# EAGLE design Arduino Programmer (EAGLE 9.6.1)
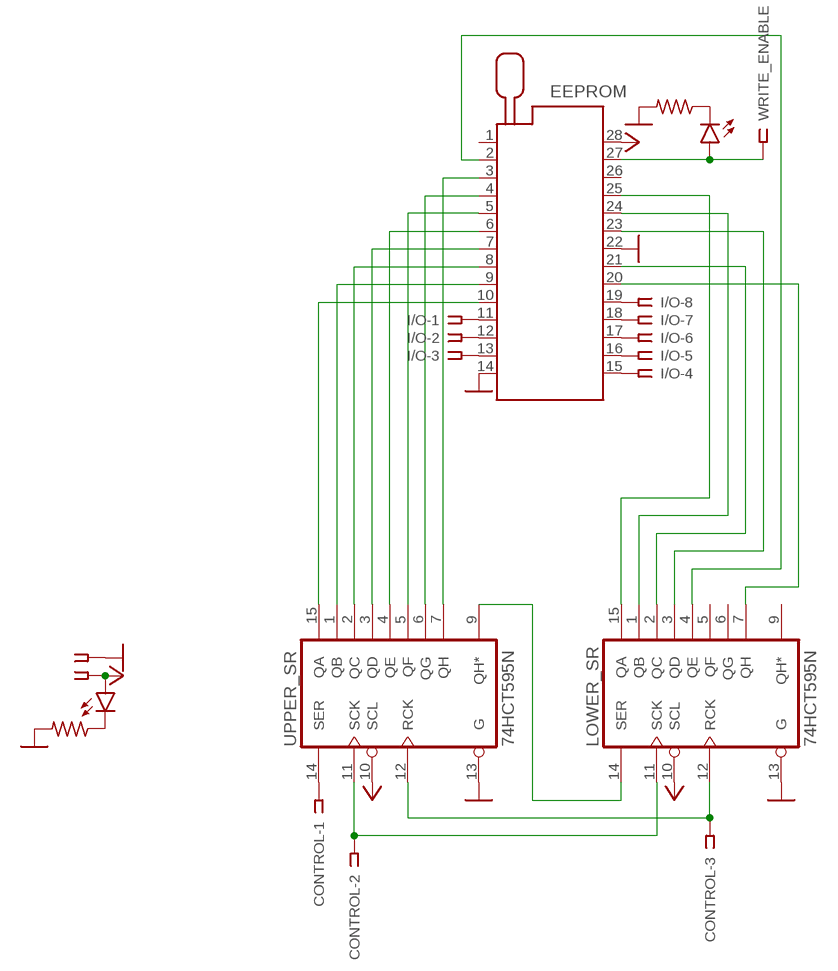
[diagram p0: schematic, sheet 1]

## Parts
CLK  LED5MM  [LED5MM]
CONTROL  SSW-101-02-G-T  [SSW-101-02-G-T]
EEPROM  228-1277-00-0602J  [228-1277-00-0602J]
I/O  SSW-108-02-G-S  [SSW-108-02-G-S]
LOWER_SR  74HCT595N  [DIL16]
POWER  LED5MM  [LED5MM]
R1  R-US_0204/7  [0204/7]
R2  R-US_0204/7  [0204/7]
UPPER_SR  74HCT595N  [DIL16]
WRITE_ENABLE  SSW-101-02-G-S  [SSW-101-02-G-S]
X2  SSW-102-02-G-S  [SSW-102-02-G-S]

## Nets
GND: EEPROM.14 EEPROM.22 LOWER_SR.13(G) R1.2 R2.2 UPPER_SR.13(G) X2.1
N$1: CONTROL.3 LOWER_SR.12(RCK) UPPER_SR.12(RCK)
N$2: CONTROL.2 LOWER_SR.11(SCK) UPPER_SR.11(SCK)
N$3: LOWER_SR.14(SER) UPPER_SR.9(QH*)
N$4: CONTROL.1 UPPER_SR.14(SER)
N$5: EEPROM.10 UPPER_SR.15(QA)
N$6: EEPROM.9 UPPER_SR.1(QB)
N$7: EEPROM.8 UPPER_SR.2(QC)
N$8: EEPROM.7 UPPER_SR.3(QD)
N$9: EEPROM.6 UPPER_SR.4(QE)
N$10: EEPROM.5 UPPER_SR.5(QF)
N$11: EEPROM.4 UPPER_SR.6(QG)
N$12: EEPROM.3 UPPER_SR.7(QH)
N$13: EEPROM.25 LOWER_SR.15(QA)
N$14: EEPROM.24 LOWER_SR.1(QB)
N$15: EEPROM.21 LOWER_SR.2(QC)
N$16: EEPROM.23 LOWER_SR.3(QD)
N$17: EEPROM.2 LOWER_SR.4(QE)
N$18: EEPROM.20 LOWER_SR.7(QH)
N$19: EEPROM.16 I/O.5
N$20: EEPROM.17 I/O.6
N$21: EEPROM.18 I/O.7
N$22: EEPROM.19 I/O.8
N$23: EEPROM.11 I/O.1
N$24: EEPROM.12 I/O.2
N$25: EEPROM.13 I/O.3
N$26: EEPROM.15 I/O.4
N$27: CLK.A EEPROM.27 WRITE_ENABLE.1
N$28: CLK.K(C) R1.1
N$29: POWER.K(C) R2.1
VCC: EEPROM.28 LOWER_SR.10(SCL) POWER.A UPPER_SR.10(SCL) X2.2
Unconnected: EEPROM.1 EEPROM.26 LOWER_SR.5(QF) LOWER_SR.6(QG) LOWER_SR.9(QH*)

## Power pins joined to a net without a drawn wire
GND: LOWER_SR.8(GND) UPPER_SR.8(GND)
VCC: LOWER_SR.16(VCC) UPPER_SR.16(VCC)

## Library data of the parts
CLK POWER = led:LED: LED OSRAM: - CHIPLED LG R971, LG N971, LY N971, LG Q971, LY Q971, LO R971, LY R971 LH N974, LH R974 LS Q976, LO Q976, LY Q976 LO Q996 - Hyper CHIPLED LW Q18S LB Q993, LB Q99A, LB R99A - SideLED LS A670, LO A670, LY A670, LG A670, LP A670 LB A673, LV A673, LT A673, LW A673 LH A674 LY A675 LS A676, LA A676, LO A676, LY A676, LW A676 LS A679, LY A679, LG A679 - Hyper Micro SIDELED® LS Y876, LA Y876, LO Y876, LY Y876 LT Y87S - SmartLED LW L88C, LW L88S LB L89C, LB L89S, LG L890 LS L89K, LO L89K, LY L89K LS L896, LA L896, LO L896, LY L896 - TOPLED LS T670, LO T670, LY T670, LG T670, LP T670 LSG T670, LSP T670, LSY T670, LOP T670, LYG T670 LG T671, LOG T671, LSG T671 LB T673, LV T673, LT T673, LW T673 LH T674 LS T676, LA T676, LO T676, LY T676, LB T676, LH T676, LSB T676, LW T676 LB T67C, LV T67C, LT T67C, LS T67K, LO T67K, LY T67K, LW E67C LS E67B, LA E67B, LO E67B, LY E67B, LB E67C, LV E67C, LT E67C LW T67C LS T679, LY T679, LG T679 LS T770, LO T770, LY T770, LG T770, LP T770 LB T773, LV T773, LT T773, LW T773 LH T774 LS E675, LA E675, LY E675, LS T675 LS T776, LA T776, LO T776, LY T776, LB T776 LHGB T686 LT T68C, LB T68C - Hyper Mini TOPLED® LB M676 - Mini TOPLED Santana® LG M470 LS M47K, LO M47K, LY M47K Source: http://www.osram.convergy.de LUXEON: - LUMILED® LXK2-PW12-R00, LXK2-PW12-S00, LXK2-PW14-U00, LXK2-PW14-V00 LXK2-PM12-R00, LXK2-PM12-S00, LXK2-PM14-U00 LXK2-PE12-Q00, LXK2-PE12-R00, LXK2-PE12-S00, LXK2-PE14-T00, LXK2-PE14-U00 LXK2-PB12-K00, LXK2-PB12-L00, LXK2-PB12-M00, LXK2-PB14-N00, LXK2-PB14-P00, LXK2-PB14-Q00 LXK2-PR12-L00, LXK2-PR12-M00, LXK2-PR14-Q00, LXK2-PR14-R00 LXK2-PD12-Q00, LXK2-PD12-R00, LXK2-PD12-S00 LXK2-PH12-R00, LXK2-PH12-S00 LXK2-PL12-P00, LXK2-PL12-Q00, LXK2-PL12-R00 Source: www.luxeon.com KINGBRIGHT: KA-3528ASYC Source: www.kingbright.com
CONTROL = con-samtec:SSW-101-02-G-T: THROUGH-HOLE .025" SQ POST SOCKET Source: Samtec SSW.pdf; MF: Samtec Inc.; MPN: SSW-101-02-G-T; OC_FARNELL: unknown; OC_NEWARK: 82P1460
EEPROM = con-3m:228-?00-0602J: Zero Insertion Force Socked Source: http://www.3M.com/ehpd; MF: 3M; MPN: 228-1277-00-0602J; OC_FARNELL: 9897356; OC_NEWARK: 85K7825
I/O = con-samtec:SSW-108-02-G-S: THROUGH-HOLE .025" SQ POST SOCKET Source: Samtec SSW.pdf; MF: Samtec Inc.; MPN: SSW-108-02-G-S; OC_FARNELL: unknown; OC_NEWARK: 11P9448
LOWER_SR UPPER_SR = 74xx-eu:74*595: 8-bit SHIFT REGISTER, output latch
R1 R2 = rcl:R-US_: RESISTOR, American symbol; SPICEPREFIX: R
WRITE_ENABLE = con-samtec:SSW-101-02-G-S: THROUGH-HOLE .025" SQ POST SOCKET Source: Samtec SSW.pdf; MF: Samtec Inc.; MPN: SSW-101-02-G-S; OC_FARNELL: unknown; OC_NEWARK: 11P9336
X2 = con-samtec:SSW-102-02-G-S: THROUGH-HOLE .025" SQ POST SOCKET Source: Samtec SSW.pdf; MF: Samtec Inc.; MPN: SSW-102-02-G-S; OC_FARNELL: unknown; OC_NEWARK: 11P9351

## Board
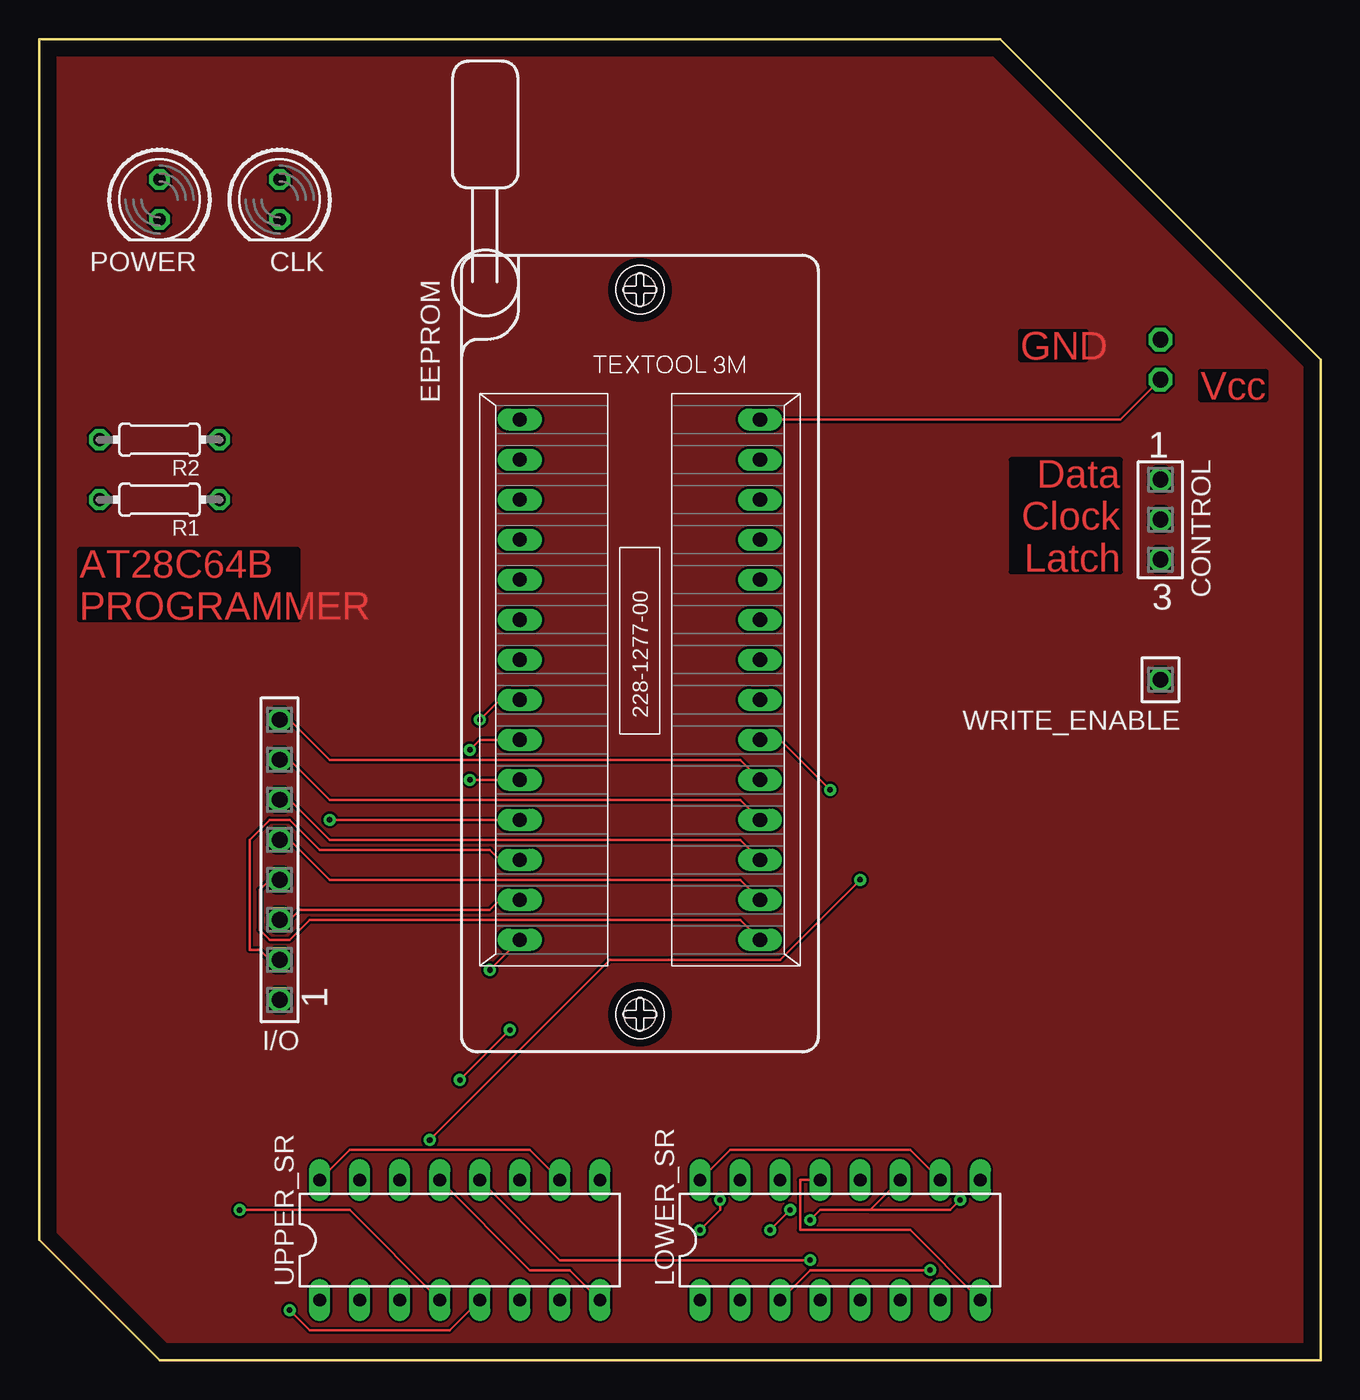
[diagram p1: board, top side]
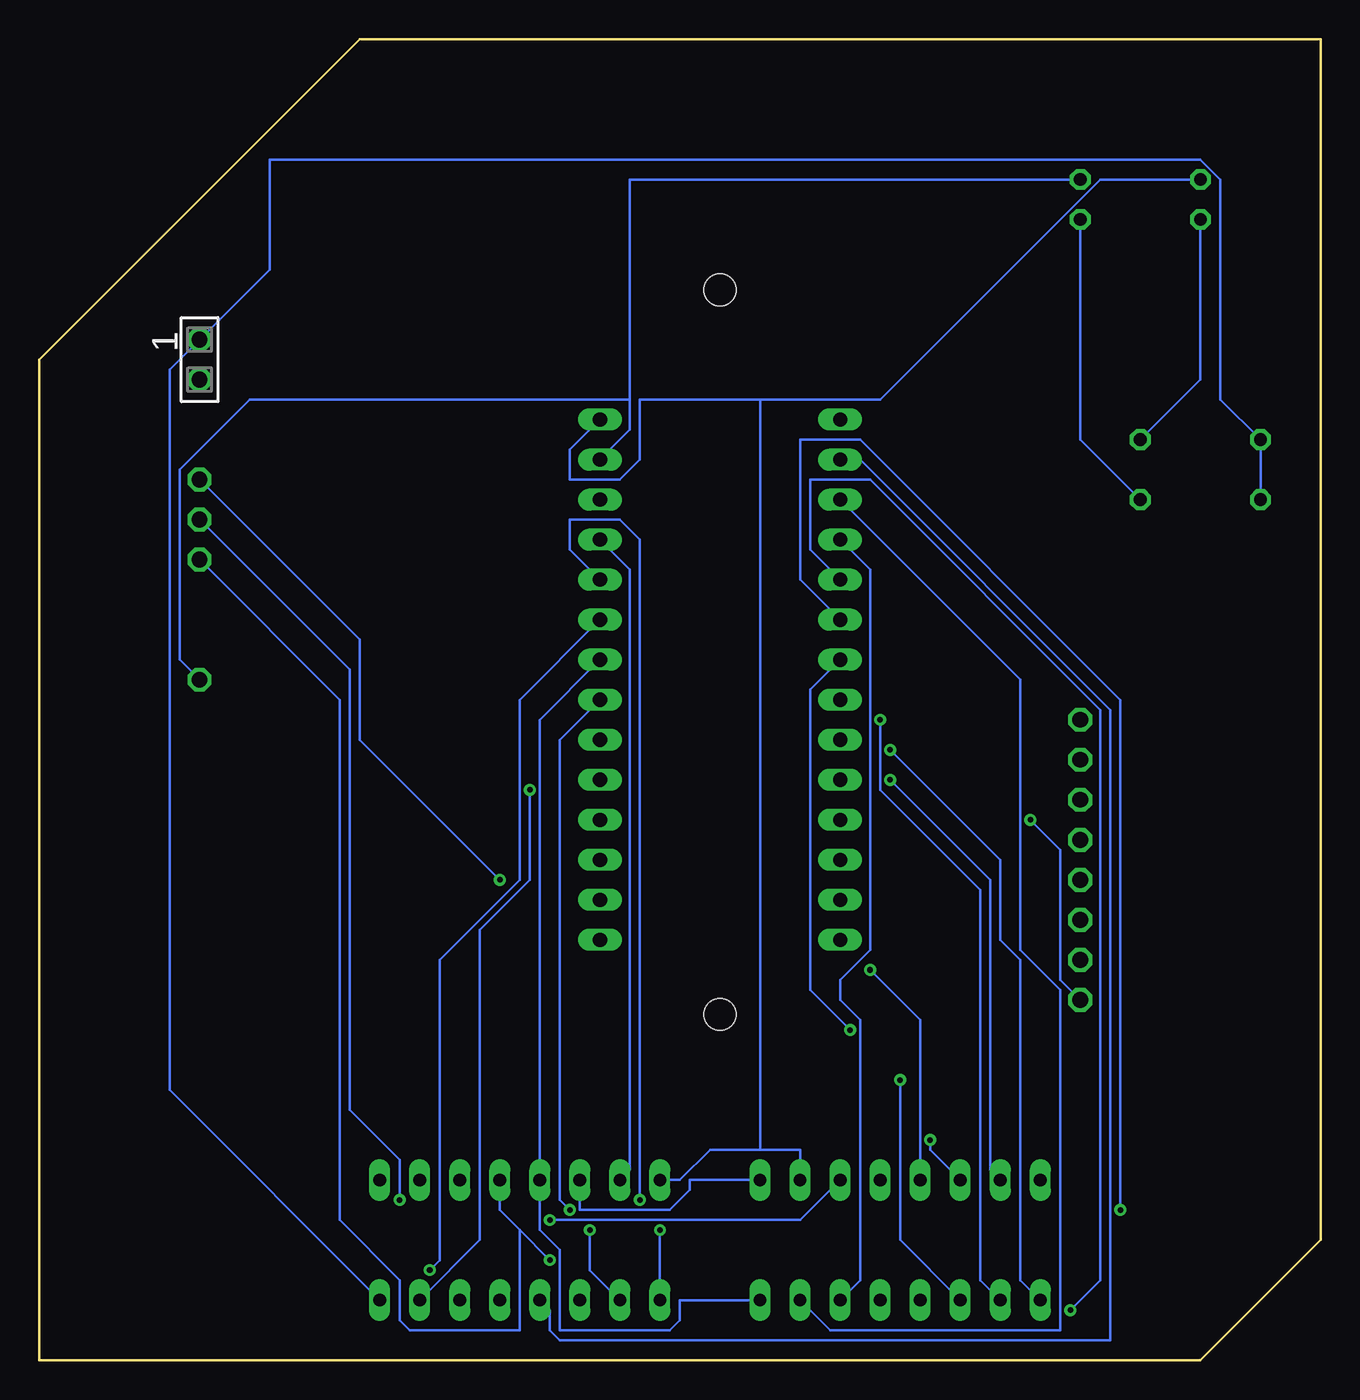
[diagram p2: board, bottom side, seen from below]

Size 81.28 x 83.82 mm. Coordinates in mm from the lower left corner, seen from the top.
Outline: 0,83.82 60.96,83.82 81.28,63.5 81.28,0 7.62,0 0,7.62 0,83.82
Copper layers (1*16): Top 0.035mm / dielectric 1.5mm / Bottom 0.035mm
Design rules "default": minimum track width 6mil, minimum drill 0.35mm, track to track 6mil, track to pad 6mil, pad to pad 6mil, via to via 6mil, smd to smd 6mil, copper to edge 40mil, drill to drill 6mil, minimum pad ring 10mil, minimum via ring 8mil, stop-mask expansion 4mil, vias tented up to drill 0mil, thermal gap 10mil

### Footprints (pad centres in the part's own frame; a part is rotated, then mirrored left to right if it is on the bottom)
LED5MM = drill 0.813 octagon: A -1.27,0; K 1.27,0
SSW-101-02-G-T = drill 1 pad 1.5 octagon: 1 0,-2.54; 2 0,0; 3 0,2.54
228-1277-00-0602J = drill 0.9 long: 1 -16.51,-7.62; 2 -13.97,-7.62; 3 -11.43,-7.62; 4 -8.89,-7.62; 5 -6.35,-7.62; 6 -3.81,-7.62; 7 -1.27,-7.62; 8 1.27,-7.62; 9 3.81,-7.62; 10 6.35,-7.62; 11 8.89,-7.62; 12 11.43,-7.62; 13 13.97,-7.62; 14 16.51,-7.62; 15 16.51,7.62; 16 13.97,7.62; 17 11.43,7.62; 18 8.89,7.62; 19 6.35,7.62; 20 3.81,7.62; 21 1.27,7.62; 22 -1.27,7.62; 23 -3.81,7.62; 24 -6.35,7.62; 25 -8.89,7.62; 26 -11.43,7.62; 27 -13.97,7.62; 28 -16.51,7.62 | hole 2: 21.24,0; -24.74,0
SSW-108-02-G-S = drill 1 pad 1.5 octagon: 1 -8.89,0; 2 -6.35,0; 3 -3.81,0; 4 -1.27,0; 5 1.27,0; 6 3.81,0; 7 6.35,0; 8 8.89,0
DIL16 = drill 0.813 long: 1 -8.89,-3.81; 2 -6.35,-3.81; 3 -3.81,-3.81; 4 -1.27,-3.81; 5 1.27,-3.81; 6 3.81,-3.81; 7 6.35,-3.81; 8 8.89,-3.81; 9 8.89,3.81; 10 6.35,3.81; 11 3.81,3.81; 12 1.27,3.81; 13 -1.27,3.81; 14 -3.81,3.81; 15 -6.35,3.81; 16 -8.89,3.81
0204/7 = drill 0.813 octagon: 1 -3.81,0; 2 3.81,0
SSW-101-02-G-S = drill 1 pad 1.5 octagon: 1 0,0
SSW-102-02-G-S = drill 1 pad 1.5 octagon: 1 -1.27,0; 2 1.27,0

### Placement (x,y rotation side)
CLK  15.24,73.66 270 top
CONTROL  71.12,53.34 180 top
EEPROM  38.1,43.18 270 top
I/O  15.24,31.75 90 top
LOWER_SR  50.8,7.62 0 top
POWER  7.62,73.66 270 top
R1  7.62,54.61 180 top
R2  7.62,58.42 180 top
UPPER_SR  26.67,7.62 0 top
WRITE_ENABLE  71.12,43.18 90 top
X2  71.12,63.5 270 bottom

### Tracks (layer width: path | path; a pad name or v marks a point on that pad's centre or on a via)
GND  (via drill 0.35)
  Top 0.152: LOWER_SR.8 55.24,8.26 48.26,8.26 48.26,11.43 LOWER_SR.13 | UPPER_SR.13 31.12,5.71 33.65,5.71 UPPER_SR.8 | v28.58,24.77 EEPROM.14
  Bottom 0.152: R1.2 R2.2 6.35,60.96 6.35,74.93 7.62,76.2 66.68,76.2 66.68,69.22 X2.1 73.03,62.86 73.03,17.15 LOWER_SR.8 | UPPER_SR.8 40.64,3.81 40.64,2.54 41.27,1.91 48.26,1.91 48.26,6.98 49.53,8.26 LOWER_SR.13 49.53,40.64 EEPROM.22 | v28.58,24.77 25.4,21.59 UPPER_SR.13
MAIN
  pour Top: 0,83.82 60.96,83.82 81.28,63.5 81.28,0 7.62,0 0,7.62
N$1  (via drill 0.35)
  Top 0.152: UPPER_SR.12 33.02,6.35 v48.9,6.35
  Bottom 0.152: 50.8,8.26 52.07,9.53 LOWER_SR.12 | 50.8,8.26 v48.9,6.35 | CONTROL.3 62.23,41.91 62.23,8.89 58.42,5.08 58.42,2.54 57.79,1.91 50.8,1.91 50.8,8.26
N$2  (via drill 0.35)
  Top 0.152: v48.9,8.89 49.53,9.53 52.71,9.53 | LOWER_SR.11 52.71,9.53 | v58.42,10.16 57.79,9.53 52.71,9.53
  Bottom 0.152: UPPER_SR.11 33.02,8.89 v48.9,8.89 | CONTROL.2 61.6,43.82 61.6,15.87 58.42,12.7 v58.42,10.16
N$3
  Bottom 0.152: UPPER_SR.9 40.01,11.43 40.01,10.79 41.27,9.53 46.99,9.53 LOWER_SR.14
N$4  (via drill 0.35)
  Top 0.152: v24.77,13.97 36.2,25.4 46.99,25.4 v52.07,30.48
  Bottom 0.152: UPPER_SR.14 24.77,13.33 v24.77,13.97 | v52.07,30.48 60.96,39.37 60.96,45.72 CONTROL.1
N$5  (via drill 0.35)
  Top 0.152: EEPROM.10 v27.3,36.83
  Bottom 0.152: UPPER_SR.15 20.95,12.06 20.95,30.48 v27.3,36.83
N$6  (via drill 0.35)
  Top 0.152: v27.3,38.73 27.94,39.37 EEPROM.9
  Bottom 0.152: UPPER_SR.1 19.05,5.08 19.05,25.4 20.32,26.67 20.32,31.75 v27.3,38.73
N$7  (via drill 0.35)
  Top 0.152: v27.94,40.64 29.21,41.91 EEPROM.8
  Bottom 0.152: UPPER_SR.2 21.59,5.08 21.59,29.84 27.94,36.2 v27.94,40.64
N$8  (via drill 0.35)
  Top 0.152: v29.85,20.95 v26.67,17.78
  Bottom 0.152: UPPER_SR.3 26.67,7.62 v26.67,17.78 | v29.85,20.95 32.38,23.49 32.38,42.55 EEPROM.7
N$9  (via drill 0.35)
  Top 0.152: UPPER_SR.4 19.69,9.53 v12.7,9.53
  Bottom 0.152: v12.7,9.53 12.7,41.91 29.21,58.42 33.02,58.42 33.02,49.53 EEPROM.6
N$10  (via drill 0.35)
  Top 0.152: UPPER_SR.5 26.04,1.91 17.15,1.91 v15.88,3.18
  Bottom 0.152: v15.88,3.18 13.97,5.08 13.97,41.27 28.58,55.88 32.38,55.88 32.38,51.44 EEPROM.5
N$11
  Bottom 0.152: UPPER_SR.6 29.21,5.08 29.21,21.59 30.48,22.86 30.48,24.13 28.58,26.03 28.58,50.16 EEPROM.4
N$12
  Bottom 0.152: UPPER_SR.7 31.12,1.91 16.51,1.91 16.51,23.49 19.05,26.03 19.05,43.18 EEPROM.3
N$13
  Bottom 0.152: LOWER_SR.15 43.82,12.06 43.82,50.16 EEPROM.25
N$14  (via drill 0.35)
  Top 0.152: v41.91,8.26 43.18,9.53 v43.18,10.16
  Bottom 0.152: v41.91,8.26 LOWER_SR.1 | v43.18,10.16 43.18,52.07 44.45,53.34 47.63,53.34 47.63,51.44 EEPROM.24
N$15  (via drill 0.35)
  Top 0.152: v47.63,9.53 v46.35,8.26
  Bottom 0.152: LOWER_SR.2 46.35,5.71 v46.35,8.26 | v47.63,9.53 48.26,10.16 48.26,39.37 EEPROM.21
N$16  (via drill 0.35)
  Top 0.152: LOWER_SR.3 48.9,5.71 v56.52,5.71
  Bottom 0.152: v56.52,5.71 55.88,6.35 55.88,25.4 50.8,30.48 50.8,41.91 EEPROM.23
N$17
  Bottom 0.152: LOWER_SR.4 48.9,3.18 48.9,1.91 48.26,1.27 13.34,1.27 13.34,41.27 29.21,57.15 EEPROM.2
N$18  (via drill 0.35)
  Top 0.152: v50.16,36.2 46.99,39.37 EEPROM.20
  Bottom 0.152: LOWER_SR.7 53.34,7.62 53.34,27.3 50.16,30.48 v50.16,36.2
N$19
  Top 0.152: EEPROM.16 44.45,30.48 18.41,30.48 15.88,33.02 I/O.5
N$20
  Top 0.152: EEPROM.17 44.45,33.02 18.41,33.02 15.88,35.56 I/O.6
N$21
  Top 0.152: EEPROM.18 44.45,35.56 18.41,35.56 15.88,38.1 I/O.7
N$22
  Top 0.152: EEPROM.19 44.45,38.1 18.41,38.1 15.88,40.64 I/O.8
N$23  (via drill 0.35)
  Top 0.152: v18.41,34.29 EEPROM.11
  Bottom 0.152: v18.41,34.29 16.51,32.39 16.51,24.13 I/O.1
N$24
  Top 0.152: EEPROM.12 29.21,31.75 28.58,32.39 17.78,32.39 15.88,34.29 14.61,34.29 13.34,33.02 13.34,26.03 13.97,26.03 14.61,25.4 I/O.2
N$25
  Top 0.152: EEPROM.13 29.21,29.21 28.58,28.58 16.51,28.58 15.88,27.94 I/O.3
N$26
  Top 0.152: EEPROM.15 44.45,27.94 17.15,27.94 15.88,26.67 14.61,26.67 13.97,27.3 13.97,29.84 14.61,30.48 I/O.4
N$27
  Bottom 0.152: CLK.A 43.82,74.93 43.82,60.96 | 43.82,60.96 43.82,59.06 EEPROM.27 | WRITE_ENABLE.1 72.39,44.45 72.39,56.52 67.94,60.96 43.82,60.96
N$28
  Bottom 0.152: R1.1 15.24,58.42 CLK.K
N$29
  Bottom 0.152: R2.1 7.62,62.23 POWER.K
VCC
  Top 0.152: UPPER_SR.16 19.69,13.33 31.12,13.33 UPPER_SR.10 | LOWER_SR.10 55.24,13.33 43.82,13.33 LOWER_SR.16 | X2.2 68.58,59.69 EEPROM.28
  Bottom 0.152: LOWER_SR.16 40.64,11.43 38.74,13.33 35.56,13.33 | 35.56,13.33 33.02,13.33 UPPER_SR.10 | POWER.A 13.97,74.93 27.94,60.96 35.56,60.96 | 35.56,60.96 43.18,60.96 43.18,57.15 44.45,55.88 47.63,55.88 47.63,57.79 EEPROM.28 | 35.56,60.96 35.56,13.33

### Text on the board
Top: GND | Vcc | Data / Clock / Latch | AT28C64B / PROGRAMMER